# EAGLE schematic PowerStage (EAGLE 6.5.0)
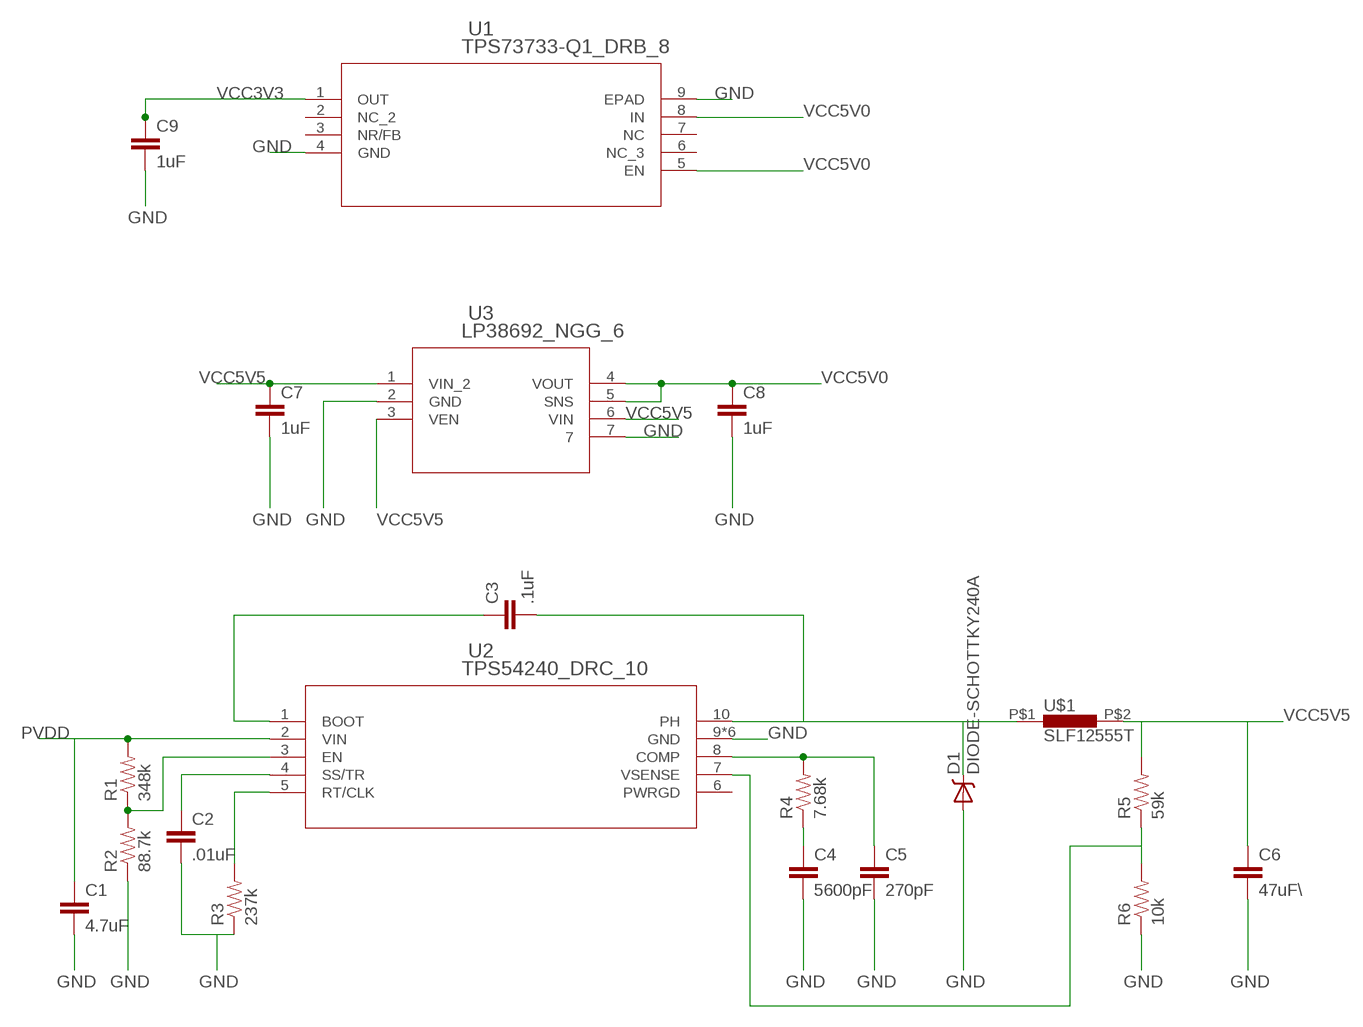
[diagram p0: schematic, sheet 1]

## Parts
C1  4.7uF  CAP1210  [1210]
C2  .01uF  CAP0805  [0805]
C3  .1uF  CAP0805  [0805]
C4  5600pF  CAP0805  [0805]
C5  270pF  CAP0805  [0805]
C6  47uF\  CAP  [C2220K]
C7  1uF  CAP0805  [0805]
C8  1uF  CAP0805  [0805]
C9  1uF  CAP0805  [0805]
D1  DIODE-SCHOTTKY240A  [SMA-DIODE-B240A]
R1  348k  RESISTOR0805-RES  [0805]
R2  88.7k  RESISTOR0805-RES  [0805]
R3  237k  RESISTOR0805-RES  [0805]
R4  7.68k  RESISTOR0805-RES  [0805]
R5  59k  RESISTOR0805-RES  [0805]
R6  10k  RESISTOR0805-RES  [0805]
U1  TPS73733-Q1_DRB_8  [DRB8_1P75X1P5]
U2  TPS54240_DRC_10  [DRC10_2P4X1P65]
U3  LP38692_NGG_6  [SDE06A]
U$1  SLF12555T  [SLF12555]

## Nets
GND: C1.2 C2.2 C4.2 C5.2 C6.2 C7.2 C8.2 C9.2 D1.A R2.1 R3.1 R6.1 U1.4(GND) U1.9(EPAD) U2.9(GND) U2.P$1(GND) U2.P$2(GND) U2.P$3(GND) U2.P$4(GND) U2.P$5(GND) U3.2(GND) U3.7
N$1: R1.1 R2.2 U2.3(EN)
N$2: C2.1 U2.4(SS/TR)
N$3: R3.2 U2.5(RT/CLK)
N$4: C3.1 U2.1(BOOT)
N$5: C3.2 D1.C U2.10(PH) U$1.P$1
N$6: C5.1 R4.2 U2.8(COMP)
N$7: C4.1 R4.1
N$9: R5.1 R6.2 U2.7(VSENSE)
PVDD: C1.1 R1.2 U2.2(VIN)
VCC3V3: C9.1 U1.1(OUT)
VCC5V0: C8.1 U1.5(EN) U1.8(IN) U3.4(VOUT) U3.5(SNS)
VCC5V5: C6.1 C7.1 R5.2 U3.1(VIN_2) U3.3(VEN) U3.6(VIN) U$1.P$2
Unconnected: U1.2(NC_2) U1.3(NR/FB) U1.6(NC_3) U1.7(NC) U2.6(PWRGD)

## Library data of the parts
C1-C9 = SwitcherPowerStage:CAP: Capacitor Standard 0603 ceramic capacitor, and 0.1" leaded capacitor.
D1 = SwitcherPowerStage:DIODE-SCHOTTKY
R1-R6 = SwitcherPowerStage:RESISTOR: Resistor Basic schematic elements and footprints for 0603, 1206, and PTH resistors.
U1 = SwitcherPowerStage:TPS73733-Q1_DRB_8; DATASHEETURL: http://www.ti.com/lit/gpn/TPS73733-Q1; DESCRIPTION: Automotive Catalog Automotive Catalog Single Output LDO, 1A, Fixed (3.3V), Reverse Current Protect; FAMILY_NAME: SINGLE CHANNEL LDO; GENERIC_PART_NUMBER: TPS73733-Q1; INDUSTRY_STD_PKG_TYPE: SON; MANUFACTURER: Texas Instruments; MANUFACTURER_PART_NUMBER: tps73733-q1_drb_8; PACKAGE_DESIGNATOR: DRB; PIN_COUNT: 8; VENDOR: Texas Instruments
U2 = SwitcherPowerStage:TPS54240_DRC_10; DATASHEETURL: http://www.ti.com/lit/gpn/TPS54240; DESCRIPTION: 3.5V to 42V Input, 2.5A Step-Down Converter with Eco-Mode; FAMILY_NAME: STEP-DOWN REGULATOR; GENERIC_PART_NUMBER: TPS54240; INDUSTRY_STD_PKG_TYPE: SON; MANUFACTURER: Texas Instruments; MANUFACTURER_PART_NUMBER: tps54240_drc_10; PACKAGE_DESIGNATOR: DRC; PIN_COUNT: 10; VENDOR: Texas Instruments
U3 = SwitcherPowerStage:LP38692_NGG_6; BASE_PN: LP38692; COMP: TypeLDO; LIBRARY: ReferenceLP38692SD; PARTNUMBER: LP38692SD-18; PIN: Count6; SYMBOL: NameLP38692SD-18; TYPE: LP38692SD-1.8; VENDOR: NationalSemiconductor; VERSION: 1
U$1 = SwitcherPowerStage:SLF12555T